# Altium schematic sheet Carte_Alim_2019_TRACO.SchDoc
size A4; Author: Audran; CompanyName: Goldorak; Address1: Electrolab; Address2: 52 rue Paul Lescop; Address3: 92000 Nanterre; DocumentNumber: 2; SheetNumber: 2; SheetTotal: 5; ProjectName: Cartes_2017
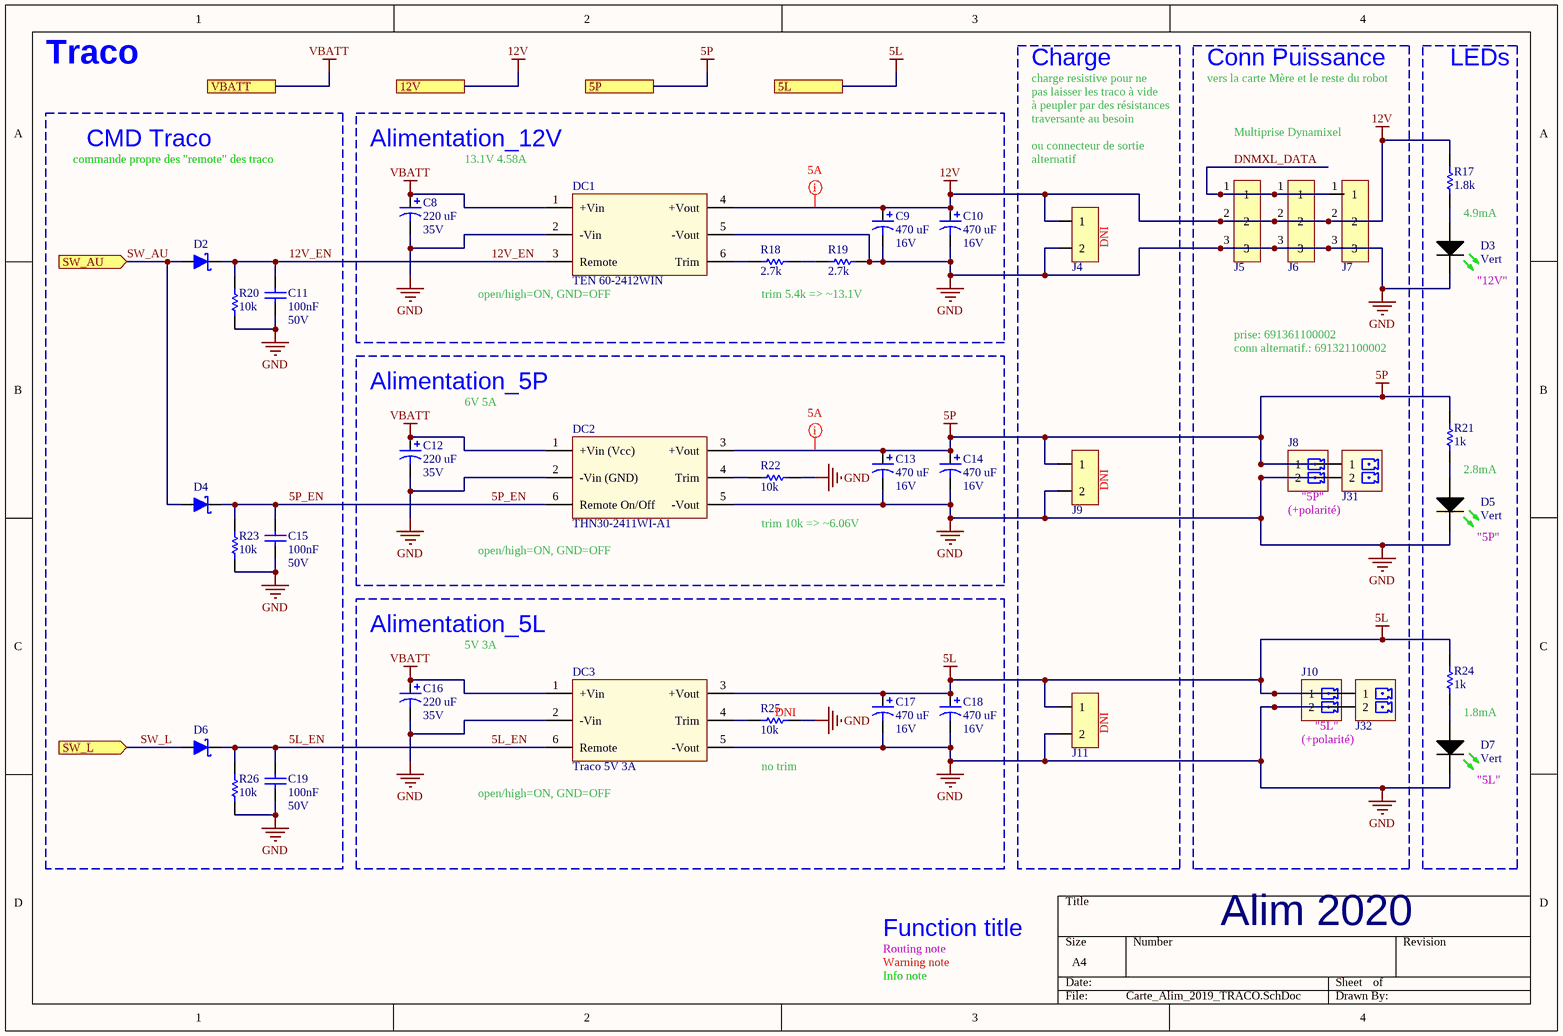
[diagram p0: Carte_Alim_2019_TRACO.SchDoc]

## Parts
C8  220 uF  RatedVoltage: 35V  [WCAP-ATG8_8x11.5x3.5x0.5]
C9  470 uF  RatedVoltage: 16V  [WCAP-ATG8_8x11.5x3.5x0.5]
C10  470 uF  RatedVoltage: 16V  [WCAP-ATG8_8x11.5x3.5x0.5]
C11  100nF  RatedVoltage: 50V  [WCAP-CSGP_0603, 1.6x0.8x0.8]
C12  220 uF  RatedVoltage: 35V  [WCAP-ATG8_8x11.5x3.5x0.5]
C13  470 uF  RatedVoltage: 16V  [WCAP-ATG8_8x11.5x3.5x0.5]
C14  470 uF  RatedVoltage: 16V  [WCAP-ATG8_8x11.5x3.5x0.5]
C15  100nF  RatedVoltage: 50V  [WCAP-CSGP_0603, 1.6x0.8x0.8]
C16  220 uF  RatedVoltage: 35V  [WCAP-ATG8_8x11.5x3.5x0.5]
C17  470 uF  RatedVoltage: 16V  [WCAP-ATG8_8x11.5x3.5x0.5]
C18  470 uF  RatedVoltage: 16V  [WCAP-ATG8_8x11.5x3.5x0.5]
C19  100nF  RatedVoltage: 50V  [WCAP-CSGP_0603, 1.6x0.8x0.8]
D2  RBR3MM40ATFTR  [SOD-123FL]  (value not drawn)
D3  Vert  [SMCW_0603]
D4  RBR3MM40ATFTR  [SOD-123FL]  (value not drawn)
D5  Vert  [SMCW_0603]
D6  RBR3MM40ATFTR  [SOD-123FL]  (value not drawn)
D7  Vert  [SMCW_0603]
DC1  TEN 60-2412WIN  [TEN 60]
DC2  THN30-2411WI-A1  [THN 30WI-A1]
DC3  Traco 5V 3A  [THN 15WI]
J4  22-03-2021  [22-03-2021]  (value not drawn)
J5  22-03-5035  [20-03-5035]  (value not drawn)
J6  22-03-5035  [20-03-5035]  (value not drawn)
J7  22-03-5035  [20-03-5035]  (value not drawn)
J8  691322110002  [691322110002]  (value not drawn)
J9  22-03-2021  [22-03-2021]  (value not drawn)
J10  691322110002  [691322110002]  (value not drawn)
J11  22-03-2021  [22-03-2021]  (value not drawn)
J31  691321100002  [691321100002]  (value not drawn)
J32  691321100002  [691321100002]  (value not drawn)
R17  value 1.8k  [RESC1608X06N]  (hidden comment: RC0603FR-071K8L)
R18  value 2.7k  [RESC2012X06M]  (hidden comment: RC0805FR-072K7L)
R19  value 2.7k  [RESC2012X06M]  (hidden comment: RC0805FR-072K7L)
R20  value 10k  [RESC1608X06N]  (hidden comment: RC0603FR-0710KL)
R21  value 1k  [RESC1608X06N]  (hidden comment: RC0603FR-071KL)
R22  value 10k  [RESC1608X06N]  (hidden comment: RC0603FR-0710KL)
R23  value 10k  [RESC1608X06N]  (hidden comment: RC0603FR-0710KL)
R24  value 1k  [RESC1608X06N]  (hidden comment: RC0603FR-071KL)
R25  value 10k  [RESC1608X06N]  (hidden comment: RC0603FR-0710KL)
R26  value 10k  [RESC1608X06N]  (hidden comment: RC0603FR-0710KL)

## Blocks framed on the sheet
Charge: J4 J9 J11
Conn Puissance: J5-J8 J10 J31 J32
LEDs: D3 D5 D7 R17 R21 R24
CMD Traco: C11 C15 C19 D2 D4 D6 R20 R23 R26
Alimentation_12V: C8-C10 DC1 R18 R19
Alimentation_5P: C12-C14 DC2 R22
Alimentation_5L: C16-C18 DC3 R25

## Ports
5L, 5P, 12V, SW_AU (in), SW_L (in), VBATT

## Nets
5L: C17.1 C18.1 DC3.3(+Vout) J10.1 J11.1 J32.1 R24.1 ; port 5L
5P: C13.1 C14.1 DC2.3(+Vout) J8.1 J9.1 J31.1 R21.1 ; port 5P
12V: C9.1 C10.1 DC1.4(+Vout) J4.1 J5.2 J6.2 J7.2 R17.2 ; port 12V
GND: C8.2 C9.2 C10.2 C11.1 C12.2 C13.2 C14.2 C15.1 C16.2 C17.2 C18.2 C19.1 D3.1(C) D5.1(C) D7.1(C) DC1.2(-Vin) DC1.5(-Vout) DC2.2(-Vin_(GND)) DC2.5(-Vout) DC3.2(-Vin) DC3.5(-Vout) J4.2 J5.3 J6.3 J7.3 J8.2 J9.2 J10.2 J11.2 J31.2 J32.2 R19.2 R20.1 R22.2 R23.1 R25.2 R26.1
VBATT: C8.1 C12.1 C16.1 DC1.1(+Vin) DC2.1(+Vin_(Vcc)) DC3.1(+Vin) ; port VBATT
5L_EN: C19.2 D6.2 DC3.6(Remote) R26.2
5P_EN: C15.2 D4.2 DC2.6(Remote_On/Off) R23.2
12V_EN: C11.2 D2.2 DC1.3(Remote) R20.2
DNMXL_DATA: J5.1 J6.1 J7.1
SW_AU: D2.1 D4.1 ; port SW_AU
SW_L: D6.1 ; port SW_L
NetD3_2: D3.2(A) R17.1
NetD5_2: D5.2(A) R21.2
NetD7_2: D7.2(A) R24.2
NetDC1_6: DC1.6(Trim) R18.1
NetDC2_4: DC2.4(Trim) R22.1
NetDC3_4: DC3.4(Trim) R25.1
NetR18_2: R18.2 R19.1

## Layout directives
net class PWR_5A: 5P, 12V

## Notes on the sheet
- Traco
- charge resistive pour ne
- à peupler par des résistances
- pas laisser les traco à vide
- vers la carte Mère et le reste du robot
- commande propre des "remote" des traco
- 13.1V 4.58A
- traversante au besoin
- ou connecteur de sortie
- alternatif
- Multiprise Dynamixel
- (near J4) DNI
- 4.9mA
- (near DC1) open/high=ON, GND=OFF
- trim 5.4k => ~13.1V
- (near D3) "12V"
- prise: 691361100002
- conn alternatif.: 691321100002
- 6V 5A
- (near J9) DNI
- (+polarité)
- "5P"
- 2.8mA
- (near DC2) open/high=ON, GND=OFF
- trim 10k => ~6.06V
- (near D5) "5P"
- 5V 3A
- (near R25) DNI
- 1.8mA
- no trim
- (near J11) DNI
- "5L"
- (near D7) "5L"
- (near DC3) open/high=ON, GND=OFF
- Routing note
- Warning note
- Info note
- Function title
- Alim 2020

## Library data of the parts
C8 C12 C16 = WCAP-ATG8, 860010574011: CAP Alu 220 UF 20% 35 V; Manufacturer: Wurth Elektronik; PublishedDate: July 2016; ComponentLink1Description: Manufacturer; ComponentLink1URL: http://www.we-online.de; ComponentLink2Description: Datasheet; ComponentLink2URL: http://katalog.we-online.de/pbs/datasheet/860010574011.pdf; Manufacturer Part Number: 860010574011; Value: 220 uF; Size: 8mmx11.5mm
C9 C10 C13 C14 C17 C18 = WCAP-ATG8, 860010374012: CAP Alu 470 UF 20% 16 V; Manufacturer: Wurth Elektronik; PublishedDate: July 2016; ComponentLink1Description: Manufacturer; ComponentLink1URL: http://www.we-online.de; ComponentLink2Description: Datasheet; ComponentLink2URL: http://katalog.we-online.de/pbs/datasheet/860010374012.pdf; Manufacturer Part Number: 860010374012; Value: 470 uF; Size: 8mmx11.5mm
C11 C15 C19 = WCAP-CSGP, 885012206095: CAP CER 100nF 50V X7R 0603; Manufacturer: Wurth Elektronik; PublishedDate: Aug 2016; ComponentLink1Description: Manufacturer; ComponentLink1URL: http://www.we-online.de; ComponentLink2Description: Datasheet; ComponentLink2URL: http://katalog.we-online.com/pbs/datasheet/885012206095.pdf; Value: 100nF; Size: 0603; CeramicType: X7R; Manufacturer Part Number: 885012206095
D2 D4 D6 = RBR3MM40ATFTR: DIODE SCHOTTKY 40V 3A SOD123-FL; Manufacturer: ROHM; Supplier 1: Farnell; Manufacturer Part Number: RBR3MM40ATFTR; ComponentLink1URL: http://www.rohm.com/web/global/products/-/product/RBR3MM40ATF; ComponentLink1Description: Manufacturer; Supplier Part Number 1: 2581593; ComponentLink2Description: Datasheet; ComponentLink2URL: http://www.farnell.com/datasheets/2067190.pdf; ContinuousForwardCurrent: 3A; ReverseVoltage: 40V; Type: Schottky
D3 D5 D7 = WL-SMCW 0603  150060GS75000: SMD mono-color Chip LED, WL-SMCW, Green; Manufacturer 1: Würth Elektronik eiSos GmbH; Manufacturer Part Number: 150060GS75000; ComponentLink1Description: Manufacturer; ComponentLink1URL: http://www.we-online.de; Created by: Christin Otto; Created Date: June 2013; ComponentLink2Description: Datasheet; ComponentLink2URL: http://katalog.we-online.com/led/datasheet/150060GS75000.pdf; Color: Green; Value: Vert; Supplier 1: Farnell; Supplier Part Number 1: 2322070
DC1 = TEN 60-2412WIN: Traco 12.0V 60W 5A; Manufacturer: TRACOPOWER; Manufacturer Part Number: TEN 60-2412WIN; Pricing: 1=65.7, 5=63.73, 10=61.82, 25=59.97 (EUR); ComponentLink1URL: http://www.farnell.com/datasheets/2200542.pdf; ComponentLink1Description: http://www.farnell.com/datasheets/2200542.pdf; Supplier 1: Farnell; Supplier Part Number 1: 2451635
DC2 = THN30-2411WI-A1: Traco 5V-6V 30W 6A; Manufacturer: TRACOPOWER; Manufacturer Part Number: THN30-2411WI-A1; ComponentLink1URL: https://www.tracopower.com/products/thn30wi.pdf; ComponentLink1Description: datasheet; Supplier 1: Digikey; Supplier Part Number 1: 1951-3302-ND
DC3 = THN15-2411WI: Traco 5V 15W 3A; Manufacturer: TRACOPOWER; Manufacturer Part Number: THN15-2411WI; Pricing: 1=65.7, 5=63.73, 10=61.82, 25=59.97 (EUR); ComponentLink1URL: http://www.farnell.com/datasheets/1866342.pdf; ComponentLink1Description: http://www.farnell.com/datasheets/1866342.pdf; Supplier 1: Farnell; Supplier Part Number 1: 1441226
J4 J9 J11 = 22-03-2021: Manufacturer 1: MOLEX; Supplier 1: Farnell; Supplier Part Number 1: 9731075; Manufacturer Part Number: 22-03-2021; Pricing: 10=0.189, 100=0.147, 200=0.119, 500=0.108, 1000=0.088, 2500=0.08, 2500=0.0711, 20000=0.064 (EUR); ComponentLink1URL: http://www.farnell.com/cad/1533907.pdf; ComponentLink1Description: http://www.farnell.com/cad/1533907.pdf; ComponentLink2URL: http://www.farnell.com/datasheets/1791308.pdf; ComponentLink2Description: http://www.farnell.com/datasheets/1791308.pdf
J5-J7 = 20-03-5035: Manufacturer 1: MOLEX; Supplier 1: Farnell; Supplier Part Number 1: 9979620; Manufacturer Part Number: 22-03-5035; Pricing: 10=0.153, 100=0.144, 250=0.118, 500=0.091, 1000=0.059, 2500=0.057, 2500=0.0441, 30000=0.0397 (EUR); ComponentLink1URL: http://www.farnell.com/cad/495071.pdf; ComponentLink1Description: http://www.farnell.com/cad/495071.pdf; ComponentLink2URL: http://www.farnell.com/datasheets/1801024.pdf; ComponentLink2Description: http://www.farnell.com/datasheets/1801024.pdf; ComponentLink3Description: http://fr.farnell.com/jsp/level5/module.jsp?moduleId=fr/418942.xml; ComponentLink3URL: http://fr.farnell.com/jsp/level5/module.jsp?moduleId=fr/418942.xml
J8 J10 = 691322110002: WR-TBL 2p Series 3221 - 3.50 mm Horizontal PCB Header; Manufacturer: Wurth Electronics Inc.; Value: 2; Supplier 1: Farnell; Manufacturer Part Number: 691322110002; ComponentLink1URL: http://katalog.we-online.de/em/datasheet/6913221100xx.pdf; ComponentLink1Description: Datasheet; Supplier Part Number 1: 1841315
J31 J32 = 691321100002: WR-TBL 2p Series 3211 - 3.50 mm Vertical PCB Header; Manufacturer: Wurth Electronics Inc.; Value: 2; Supplier 1: Farnell; Manufacturer Part Number: 691321100002; Supplier Part Number 1: 1841308; ComponentLink1Description: Datasheet; ComponentLink1URL: https://katalog.we-online.de/em/datasheet/6913211000xx.pdf
R17 = RC0603FR-071K8L: RES SMD 1.8K OHM 1% 1/10W 0603; Manufacturer: Yageo; Power: 100mW; Vmax: 50V; Manufacturer Part Number: RC0603FR-071K8L; Type: Thick Film; ComponentLink1Description: Manufacturer; ComponentLink1URL: http://www.yageo.com/NewPortal/_en/index.jsp; ComponentLink2Description: Datasheet; ComponentLink2URL: http://www.farnell.com/datasheets/2167052.pdf; Precision: ±1%; Supplier 1: Farnell; Supplier Part Number 1: 9238514
R18 R19 = RC0805FR-072K7L: RES SMD 2K7 OHM 1% 1/8W 0805; Manufacturer: Yageo; Power: 125mW; Vmax: 50V; Manufacturer Part Number: RC0805FR-072K7L; Type: Thick Film; ComponentLink1Description: Manufacturer; ComponentLink1URL: http://www.yageo.com/NewPortal/_en/index.jsp; ComponentLink2Description: Datasheet; ComponentLink2URL: http://www.farnell.com/datasheets/444164.pdf; Supplier 1: Farnell; Supplier Part Number 1: 9237666; Precision: ±1%
R20 R22 R23 R25 R26 = RC0603FR-0710KL: RES SMD 10K OHM 1% 1/10W 0603; Manufacturer: Yageo; Power: 100mW; Vmax: 50V; Manufacturer Part Number: RC0603FR-0710KL; Type: Thick Film; ComponentLink1Description: Manufacturer; ComponentLink1URL: http://www.yageo.com/NewPortal/_en/index.jsp; ComponentLink2Description: Datasheet; ComponentLink2URL: http://www.farnell.com/datasheets/2167052.pdf; Supplier 1: Farnell; Supplier Part Number 1: 9238603; Precision: ±1%
R21 R24 = RC0603FR-071KL: RES SMD 1K OHM 1% 1/10W 0603; Manufacturer: Yageo; Power: 100mW; Vmax: 50V; Manufacturer Part Number: RC0603FR-071KL; Type: Thick Film; ComponentLink1Description: Manufacturer; ComponentLink1URL: http://www.yageo.com/NewPortal/_en/index.jsp; ComponentLink2Description: Datasheet; ComponentLink2URL: http://www.farnell.com/datasheets/2167052.pdf; Precision: ±1%; Supplier 1: Farnell; Supplier Part Number 1: 9238484